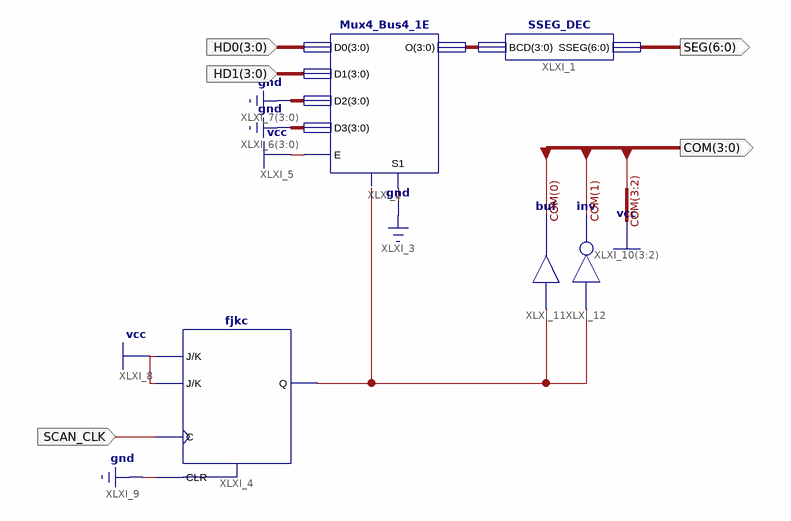
[diagram p0: schematic sheet 1]
// Xilinx ISE schematic displayer.sch (spartan6) as structural Verilog: 5 symbols, 5 ports
module displayer (
  input  [3:0] HD0,
  input  [3:0] HD1,
  input  SCAN_CLK,
  output [6:0] SEG,
  output [3:0] COM
);

  wire XLXN_5;
  wire [3:0] XLXN_1;

  SSEG_DEC XLXI_1 (.BCD(XLXN_1), .SSEG(SEG));
  Mux4_Bus4_1E XLXI_2 (.D0(HD0), .O(XLXN_1), .E(1'b1), .S1(1'b0), .S0(XLXN_5), .D1(HD1), .D2(4'b0000), .D3(4'b0000));
  fjkc XLXI_4 (.C(SCAN_CLK), .CLR(1'b0), .J(1'b1), .K(1'b1), .Q(XLXN_5));
  buf XLXI_11 (COM[0], XLXN_5);
  not XLXI_12 (COM[1], XLXN_5);

  assign COM[3:2] = 2'b11;
endmodule
